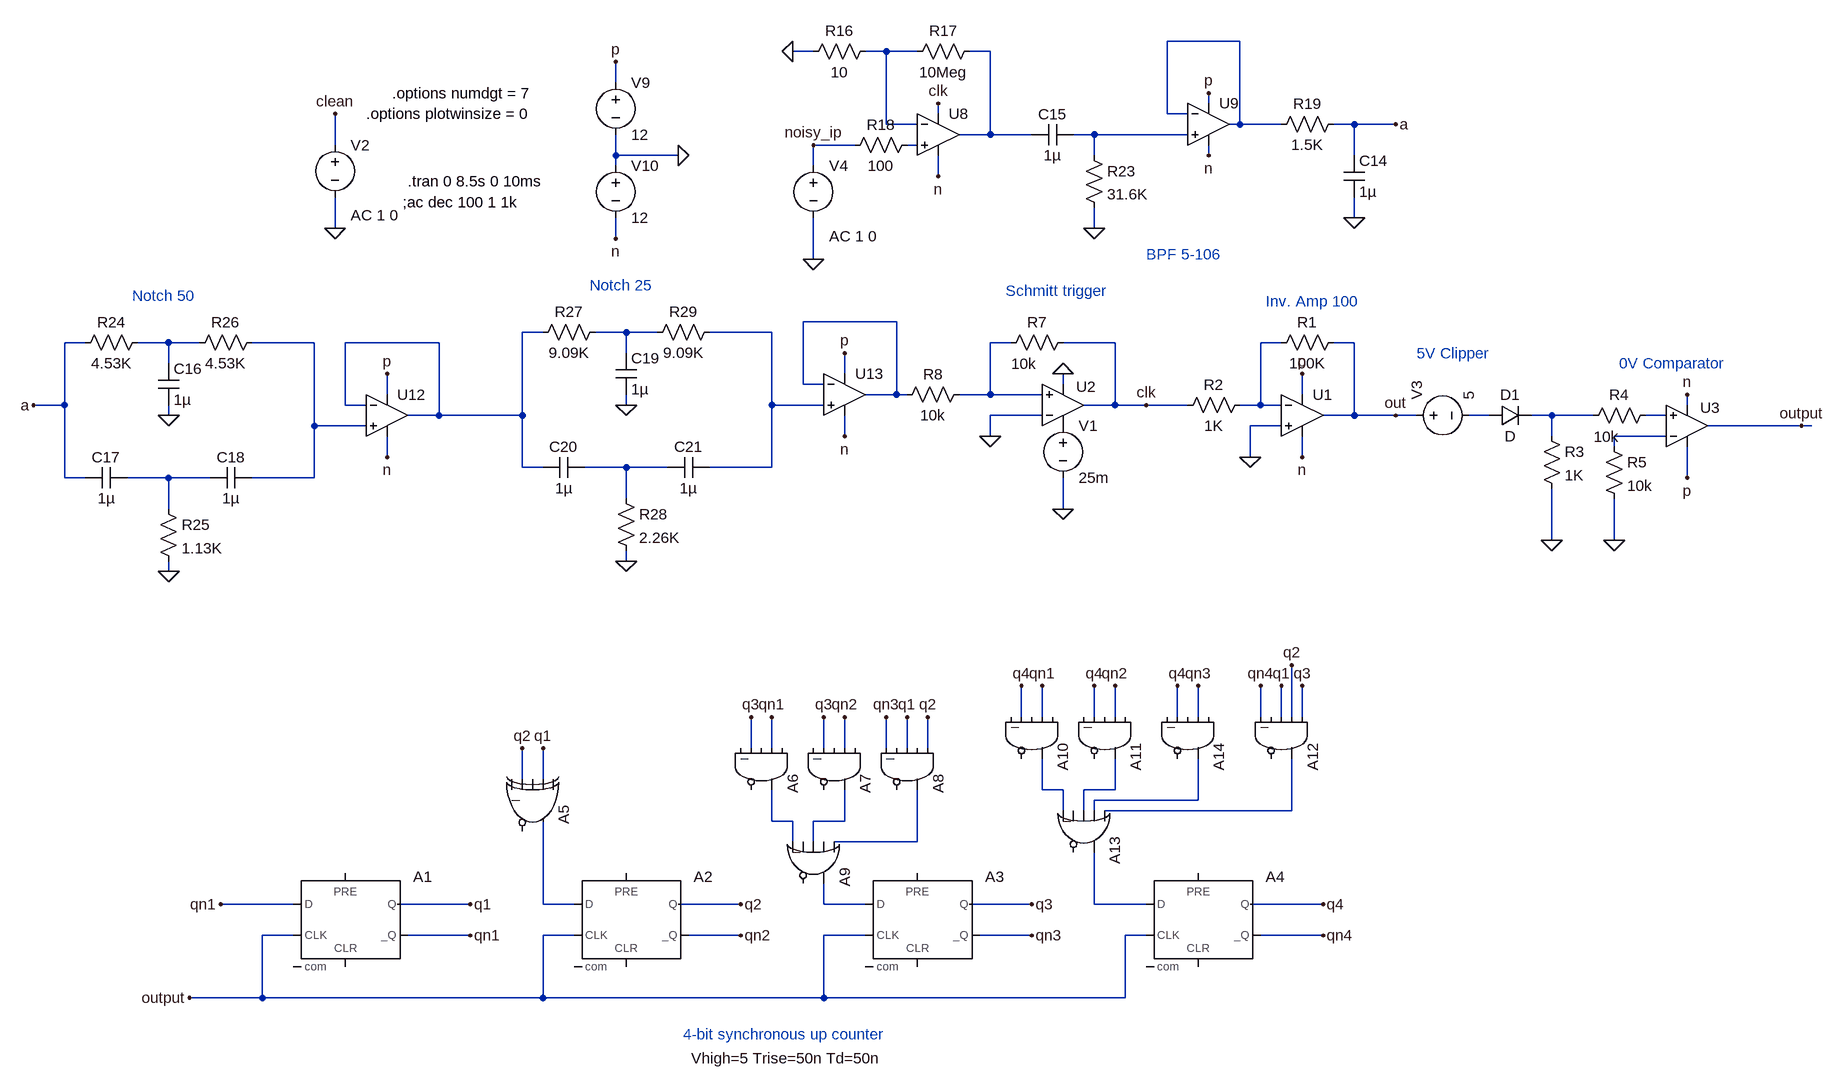
[diagram p0: schematic full ckt.asc]
full ckt.asc, the LTspice schematic file:
Version 4
SHEET 1 4760 1540
WIRE 2384 -832 2272 -832
WIRE 1728 -816 1696 -816
WIRE 1840 -816 1808 -816
WIRE 1888 -816 1840 -816
WIRE 2000 -816 1968 -816
WIRE 1424 -768 1424 -800
WIRE 2336 -736 2336 -752
WIRE 1920 -720 1920 -736
WIRE 2272 -720 2272 -832
WIRE 2304 -720 2272 -720
WIRE 1840 -704 1840 -816
WIRE 1888 -704 1840 -704
WIRE 2384 -704 2384 -832
WIRE 2384 -704 2368 -704
WIRE 2448 -704 2384 -704
WIRE 2560 -704 2528 -704
WIRE 2624 -704 2560 -704
WIRE 2000 -688 2000 -816
WIRE 2000 -688 1952 -688
WIRE 2064 -688 2000 -688
WIRE 2160 -688 2128 -688
WIRE 2304 -688 2160 -688
WIRE 992 -672 992 -720
WIRE 1792 -672 1728 -672
WIRE 1888 -672 1872 -672
WIRE 1424 -656 1424 -688
WIRE 1520 -656 1424 -656
WIRE 2160 -656 2160 -688
WIRE 2336 -656 2336 -672
WIRE 2560 -656 2560 -704
WIRE 1424 -640 1424 -656
WIRE 1728 -640 1728 -672
WIRE 1920 -624 1920 -656
WIRE 2560 -560 2560 -592
WIRE 992 -544 992 -592
WIRE 2160 -544 2160 -576
WIRE 1424 -528 1424 -560
WIRE 1728 -496 1728 -560
WIRE 1856 -400 1712 -400
WIRE 1312 -384 1280 -384
WIRE 1440 -384 1392 -384
WIRE 1488 -384 1440 -384
WIRE 1664 -384 1568 -384
WIRE 608 -368 576 -368
WIRE 736 -368 688 -368
WIRE 784 -368 736 -368
WIRE 960 -368 864 -368
WIRE 1152 -368 1008 -368
WIRE 2032 -368 2000 -368
WIRE 2192 -368 2112 -368
WIRE 2448 -368 2416 -368
WIRE 2560 -368 2528 -368
WIRE 1440 -352 1440 -384
WIRE 736 -336 736 -368
WIRE 1776 -320 1776 -352
WIRE 1712 -304 1712 -400
WIRE 1744 -304 1712 -304
WIRE 2112 -304 2112 -320
WIRE 1072 -288 1072 -320
WIRE 1856 -288 1856 -400
WIRE 1856 -288 1808 -288
WIRE 1872 -288 1856 -288
WIRE 2000 -288 2000 -368
WIRE 2000 -288 1952 -288
WIRE 2080 -288 2000 -288
WIRE 2480 -288 2480 -320
WIRE 576 -272 576 -368
WIRE 576 -272 528 -272
WIRE 1008 -272 1008 -368
WIRE 1040 -272 1008 -272
WIRE 1440 -272 1440 -288
WIRE 1664 -272 1664 -384
WIRE 1744 -272 1664 -272
WIRE 2192 -272 2192 -368
WIRE 2192 -272 2144 -272
WIRE 2240 -272 2192 -272
WIRE 2304 -272 2240 -272
WIRE 2416 -272 2416 -368
WIRE 2416 -272 2384 -272
WIRE 2448 -272 2416 -272
WIRE 3072 -272 3072 -288
WIRE 736 -256 736 -272
WIRE 1152 -256 1152 -368
WIRE 1152 -256 1104 -256
WIRE 1280 -256 1280 -384
WIRE 1280 -256 1152 -256
WIRE 2080 -256 2000 -256
WIRE 2560 -256 2560 -368
WIRE 2560 -256 2512 -256
WIRE 2624 -256 2560 -256
WIRE 2656 -256 2624 -256
WIRE 2768 -256 2736 -256
WIRE 2864 -256 2832 -256
WIRE 2928 -256 2864 -256
WIRE 3040 -256 3008 -256
WIRE 960 -240 960 -368
WIRE 1040 -240 960 -240
WIRE 2448 -240 2400 -240
WIRE 3248 -240 3104 -240
WIRE 3264 -240 3248 -240
WIRE 1776 -224 1776 -256
WIRE 2000 -224 2000 -256
WIRE 2864 -224 2864 -256
WIRE 3040 -224 2960 -224
WIRE 2960 -208 2960 -224
WIRE 1072 -192 1072 -224
WIRE 2400 -192 2400 -240
WIRE 2480 -192 2480 -224
WIRE 1280 -176 1280 -256
WIRE 1312 -176 1280 -176
WIRE 1440 -176 1376 -176
WIRE 1504 -176 1440 -176
WIRE 1664 -176 1664 -272
WIRE 1664 -176 1568 -176
WIRE 576 -160 576 -272
WIRE 608 -160 576 -160
WIRE 736 -160 672 -160
WIRE 800 -160 736 -160
WIRE 960 -160 960 -240
WIRE 960 -160 864 -160
WIRE 3072 -160 3072 -208
WIRE 1440 -128 1440 -176
WIRE 736 -112 736 -160
WIRE 2112 -112 2112 -160
WIRE 2864 -64 2864 -144
WIRE 2960 -64 2960 -128
WIRE 1440 -32 1440 -48
WIRE 736 -16 736 -32
WIRE 2048 208 2048 160
WIRE 2080 208 2080 160
WIRE 2160 208 2160 160
WIRE 2192 208 2192 160
WIRE 2288 208 2288 160
WIRE 2320 208 2320 160
WIRE 2416 208 2416 160
WIRE 2448 208 2448 160
WIRE 2464 208 2464 128
WIRE 2480 208 2480 160
WIRE 1632 256 1632 208
WIRE 1664 256 1664 208
WIRE 1744 256 1744 208
WIRE 1776 256 1776 208
WIRE 1840 256 1840 208
WIRE 1872 256 1872 208
WIRE 1904 256 1904 208
WIRE 1280 304 1280 256
WIRE 1312 304 1312 256
WIRE 2080 320 2080 272
WIRE 2112 320 2080 320
WIRE 2192 320 2192 272
WIRE 2192 320 2144 320
WIRE 2320 336 2320 272
WIRE 2320 336 2160 336
WIRE 2112 352 2112 320
WIRE 2144 352 2144 320
WIRE 2160 352 2160 336
WIRE 2464 352 2464 272
WIRE 2464 352 2176 352
WIRE 1664 368 1664 320
WIRE 1696 368 1664 368
WIRE 1776 368 1776 320
WIRE 1776 368 1728 368
WIRE 1696 400 1696 368
WIRE 1728 400 1728 368
WIRE 1888 400 1888 320
WIRE 1888 400 1760 400
WIRE 928 496 816 496
WIRE 1200 496 1088 496
WIRE 1312 496 1312 368
WIRE 1360 496 1312 496
WIRE 1616 496 1520 496
WIRE 1744 496 1744 464
WIRE 1808 496 1744 496
WIRE 2064 496 1968 496
WIRE 2160 496 2160 416
WIRE 2240 496 2160 496
WIRE 2512 496 2400 496
WIRE 928 544 880 544
WIRE 1200 544 1104 544
WIRE 1360 544 1312 544
WIRE 1616 544 1536 544
WIRE 1808 544 1744 544
WIRE 2064 544 1984 544
WIRE 2240 544 2208 544
WIRE 2512 544 2416 544
WIRE 880 640 880 544
WIRE 880 640 768 640
WIRE 1312 640 1312 544
WIRE 1312 640 880 640
WIRE 1744 640 1744 544
WIRE 1744 640 1312 640
WIRE 2208 640 2208 544
WIRE 2208 640 1744 640
FLAG 992 -544 0
FLAG 992 -720 clean
FLAG 1520 -656 0
FLAG 1424 -800 p
FLAG 1424 -528 n
FLAG 1696 -816 0
FLAG 1728 -496 0
FLAG 2336 -752 p
FLAG 2160 -544 0
FLAG 2560 -560 0
FLAG 736 -256 0
FLAG 736 -16 0
FLAG 1072 -320 p
FLAG 1440 -272 0
FLAG 1440 -32 0
FLAG 1776 -352 p
FLAG 2624 -256 out
FLAG 2336 -656 n
FLAG 1072 -192 n
FLAG 1776 -224 n
FLAG 2112 -112 0
FLAG 2240 -272 clk
FLAG 2112 -320 0
FLAG 1920 -624 n
FLAG 1920 -736 clk
FLAG 2480 -320 p
FLAG 2480 -192 n
FLAG 2400 -192 0
FLAG 2000 -224 0
FLAG 2624 -704 a
FLAG 528 -272 a
FLAG 2864 -64 0
FLAG 2960 -64 0
FLAG 3072 -160 p
FLAG 3072 -288 n
FLAG 3248 -240 output
FLAG 1728 -672 noisy_ip
FLAG 1200 496 q1
FLAG 1200 544 qn1
FLAG 1616 496 q2
FLAG 1616 544 qn2
FLAG 2064 496 q3
FLAG 2064 544 qn3
FLAG 2512 496 q4
FLAG 2512 544 qn4
FLAG 816 496 qn1
FLAG 1280 256 q2
FLAG 1312 256 q1
FLAG 1632 208 q3
FLAG 1744 208 q3
FLAG 1664 208 qn1
FLAG 1776 208 qn2
FLAG 1840 208 qn3
FLAG 1872 208 q1
FLAG 1904 208 q2
FLAG 2048 160 q4
FLAG 2160 160 q4
FLAG 2080 160 qn1
FLAG 2192 160 qn2
FLAG 2416 160 qn4
FLAG 2448 160 q1
FLAG 2480 160 q3
FLAG 2288 160 q4
FLAG 2320 160 qn3
FLAG 2464 128 q2
FLAG 768 640 output
SYMBOL voltage 992 -688 R0
WINDOW 3 24 96 Invisible 2
WINDOW 123 24 124 Left 2
WINDOW 39 0 0 Left 0
SYMATTR Value PWL file="C:\Users\SHLOK JAGUSHTE\Downloads\normal_ecg_sample (just for reference).txt"
SYMATTR Value2 AC 1 0
SYMATTR InstName V2
SYMBOL voltage 1424 -784 R0
WINDOW 123 0 0 Left 0
WINDOW 39 0 0 Left 0
SYMATTR InstName V9
SYMATTR Value 12
SYMBOL voltage 1424 -656 R0
WINDOW 123 0 0 Left 0
WINDOW 39 0 0 Left 0
SYMATTR InstName V10
SYMATTR Value 12
SYMBOL Opamps\\UniversalOpamp2 1920 -688 R0
SYMATTR InstName U8
SYMBOL res 1824 -832 R90
WINDOW 0 0 56 VBottom 2
WINDOW 3 32 56 VTop 2
SYMATTR InstName R16
SYMATTR Value 10
SYMATTR SpiceLine tol=1 pwr=0.1
SYMBOL res 1984 -832 R90
WINDOW 0 0 56 VBottom 2
WINDOW 3 32 56 VTop 2
SYMATTR InstName R17
SYMATTR Value 10Meg
SYMATTR SpiceLine tol=1 pwr=0.1
SYMBOL res 1888 -688 R90
WINDOW 0 0 56 VBottom 2
WINDOW 3 32 56 VTop 2
SYMATTR InstName R18
SYMATTR Value 100
SYMATTR SpiceLine tol=1 pwr=0.1
SYMBOL Opamps\\UniversalOpamp2 2336 -704 R0
SYMATTR InstName U9
SYMBOL cap 2544 -656 R0
SYMATTR InstName C14
SYMATTR Value 1µ
SYMATTR SpiceLine V=4 Irms=0 Rser=0 Lser=0
SYMBOL res 2432 -688 R270
WINDOW 0 32 56 VTop 2
WINDOW 3 0 56 VBottom 2
SYMATTR InstName R19
SYMATTR Value 1.5K
SYMATTR SpiceLine tol=1 pwr=0.1
SYMBOL cap 2128 -704 R90
WINDOW 0 0 32 VBottom 2
WINDOW 3 32 32 VTop 2
SYMATTR InstName C15
SYMATTR Value 1µ
SYMATTR SpiceLine V=4 Irms=0 Rser=0 Lser=0
SYMBOL res 2144 -672 R0
SYMATTR InstName R23
SYMATTR Value 31.6K
SYMATTR SpiceLine tol=1 pwr=0.1
SYMBOL res 704 -384 R90
WINDOW 0 0 56 VBottom 2
WINDOW 3 32 56 VTop 2
SYMATTR InstName R24
SYMATTR Value 4.53K
SYMATTR SpiceLine tol=1 pwr=0.1
SYMBOL cap 720 -336 R0
SYMATTR InstName C16
SYMATTR Value 1µ
SYMATTR SpiceLine V=4 Irms=0 Rser=0 Lser=0 mfg="Murata" pn="GRM153R60G105ME95" type="X5R"
SYMBOL res 720 -128 R0
SYMATTR InstName R25
SYMATTR Value 1.13K
SYMATTR SpiceLine tol=1 pwr=0.1
SYMBOL cap 672 -176 R90
WINDOW 0 0 32 VBottom 2
WINDOW 3 32 32 VTop 2
SYMATTR InstName C17
SYMATTR Value 1µ
SYMATTR SpiceLine V=4 Irms=0 Rser=0 Lser=0 mfg="Murata" pn="GRM155R70G105MA12" type="X7R"
SYMBOL cap 864 -176 R90
WINDOW 0 0 32 VBottom 2
WINDOW 3 32 32 VTop 2
SYMATTR InstName C18
SYMATTR Value 1µ
SYMATTR SpiceLine V=4 Irms=0 Rser=0 Lser=0 mfg="Murata" pn="GRM155R70G105MA12" type="X7R"
SYMBOL res 880 -384 R90
WINDOW 0 0 56 VBottom 2
WINDOW 3 32 56 VTop 2
SYMATTR InstName R26
SYMATTR Value 4.53K
SYMATTR SpiceLine tol=1 pwr=0.1
SYMBOL Opamps\\UniversalOpamp2 1072 -256 R0
SYMATTR InstName U12
SYMBOL res 1408 -400 R90
WINDOW 0 0 56 VBottom 2
WINDOW 3 32 56 VTop 2
SYMATTR InstName R27
SYMATTR Value 9.09K
SYMATTR SpiceLine tol=1 pwr=0.1
SYMBOL cap 1424 -352 R0
SYMATTR InstName C19
SYMATTR Value 1µ
SYMATTR SpiceLine V=4 Irms=0 Rser=0 Lser=0 mfg="Murata" pn="GRM153R60G105ME95" type="X5R"
SYMBOL res 1424 -144 R0
SYMATTR InstName R28
SYMATTR Value 2.26K
SYMATTR SpiceLine tol=1 pwr=0.1
SYMBOL cap 1376 -192 R90
WINDOW 0 0 32 VBottom 2
WINDOW 3 32 32 VTop 2
SYMATTR InstName C20
SYMATTR Value 1µ
SYMATTR SpiceLine V=4 Irms=0 Rser=0 Lser=0 mfg="Murata" pn="GRM155R70G105MA12" type="X7R"
SYMBOL cap 1568 -192 R90
WINDOW 0 0 32 VBottom 2
WINDOW 3 32 32 VTop 2
SYMATTR InstName C21
SYMATTR Value 1µ
SYMATTR SpiceLine V=4 Irms=0 Rser=0 Lser=0 mfg="Murata" pn="GRM155R70G105MA12" type="X7R"
SYMBOL Opamps\\UniversalOpamp2 1776 -288 R0
SYMATTR InstName U13
SYMBOL res 1584 -400 R90
WINDOW 0 0 56 VBottom 2
WINDOW 3 32 56 VTop 2
SYMATTR InstName R29
SYMATTR Value 9.09K
SYMATTR SpiceLine tol=1 pwr=0.1
SYMBOL voltage 1728 -656 R0
WINDOW 3 24 99 Invisible 2
WINDOW 123 24 124 Left 2
WINDOW 39 0 0 Left 0
SYMATTR Value PWL file="C:\Users\SHLOK JAGUSHTE\Downloads\noisy_ecg_sample.txt"
SYMATTR Value2 AC 1 0
SYMATTR InstName V4
SYMBOL Opamps\\UniversalOpamp2 2112 -272 M180
WINDOW 0 20 28 Left 2
SYMATTR InstName U2
SYMBOL res 2128 -384 R90
WINDOW 0 0 56 VBottom 2
WINDOW 3 33 76 VTop 2
SYMATTR InstName R7
SYMATTR Value 10k
SYMATTR SpiceLine tol=1 pwr=0.1
SYMBOL voltage 2112 -256 R0
WINDOW 123 0 0 Left 0
WINDOW 39 0 0 Left 0
SYMATTR InstName V1
SYMATTR Value 25m
SYMBOL res 1968 -304 R90
WINDOW 0 0 56 VBottom 2
WINDOW 3 32 56 VTop 2
SYMATTR InstName R8
SYMATTR Value 10k
SYMATTR SpiceLine tol=1 pwr=0.1
SYMBOL Opamps\\UniversalOpamp2 2480 -256 R0
SYMATTR InstName U1
SYMBOL res 2544 -384 R90
WINDOW 0 0 56 VBottom 2
WINDOW 3 32 56 VTop 2
SYMATTR InstName R1
SYMATTR Value 100K
SYMATTR SpiceLine tol=1 pwr=0.1
SYMBOL res 2400 -288 R90
WINDOW 0 0 56 VBottom 2
WINDOW 3 32 56 VTop 2
SYMATTR InstName R2
SYMATTR Value 1K
SYMATTR SpiceLine tol=1 pwr=0.1
SYMBOL voltage 2640 -256 R270
WINDOW 123 0 0 Left 0
WINDOW 39 0 0 Left 0
SYMATTR InstName V3
SYMATTR Value 5
SYMBOL diode 2768 -240 R270
WINDOW 0 32 32 VTop 2
WINDOW 3 0 32 VBottom 2
SYMATTR InstName D1
SYMBOL res 2848 -240 R0
SYMATTR InstName R3
SYMATTR Value 1K
SYMATTR SpiceLine tol=1 pwr=0.1
SYMBOL Opamps\\UniversalOpamp2 3072 -240 M180
WINDOW 0 20 28 Left 2
SYMATTR InstName U3
SYMBOL res 3024 -272 R90
WINDOW 0 0 56 VBottom 2
WINDOW 3 33 76 VTop 2
SYMATTR InstName R4
SYMATTR Value 10k
SYMATTR SpiceLine tol=1 pwr=0.1
SYMBOL res 2944 -224 R0
SYMATTR InstName R5
SYMATTR Value 10k
SYMATTR SpiceLine tol=1 pwr=0.1
SYMBOL Digital\\dflop 1008 448 R0
WINDOW 3 8 12 Invisible 2
SYMATTR Value Vhigh=5 Trise=50n Td=50n
SYMATTR InstName A1
SYMBOL Digital\\dflop 1440 448 R0
WINDOW 3 8 168 Invisible 2
SYMATTR Value Vhigh=5 Trise=50n Td=50n
SYMATTR InstName A2
SYMBOL Digital\\dflop 1888 448 R0
WINDOW 3 8 168 Invisible 2
SYMATTR Value Vhigh=5 Trise=50n Td=50n
SYMATTR InstName A3
SYMBOL Digital\\dflop 2320 448 R0
WINDOW 3 -780 285 Left 2
SYMATTR Value Vhigh=5 Trise=50n Td=50n
SYMATTR InstName A4
SYMBOL Digital\\xor 1360 352 R90
WINDOW 3 16 52 Invisible 2
SYMATTR Value Vhigh=5 Trise=50n Td=50n
SYMATTR InstName A5
SYMBOL Digital\\and 1712 288 R90
WINDOW 3 16 112 Invisible 2
SYMATTR Value Vhigh=5 Trise=50n Td=50n
SYMATTR InstName A6
SYMBOL Digital\\and 1824 288 R90
WINDOW 3 16 112 Invisible 2
SYMATTR Value Vhigh=5 Trise=50n Td=50n
SYMATTR InstName A7
SYMBOL Digital\\and 1936 288 R90
WINDOW 3 16 112 Invisible 2
SYMATTR Value Vhigh=5 Trise=50n Td=50n
SYMATTR InstName A8
SYMBOL Digital\\or 1792 432 R90
WINDOW 3 -8 128 Invisible 2
SYMATTR Value Vhigh=5 Trise=50n Td=50n
SYMATTR InstName A9
SYMBOL Digital\\and 2128 240 R90
WINDOW 3 16 112 Invisible 2
SYMATTR Value Vhigh=5 Trise=50n Td=50n
SYMATTR InstName A10
SYMBOL Digital\\and 2240 240 R90
WINDOW 3 16 112 Invisible 2
SYMATTR Value Vhigh=5 Trise=50n Td=50n
SYMATTR InstName A11
SYMBOL Digital\\and 2512 240 R90
WINDOW 3 16 112 Invisible 2
SYMATTR Value Vhigh=5 Trise=50n Td=50n
SYMATTR InstName A12
SYMBOL Digital\\or 2208 384 R90
WINDOW 3 -8 128 Invisible 2
SYMATTR Value Vhigh=5 Trise=50n Td=50n
SYMATTR InstName A13
SYMBOL Digital\\and 2368 240 R90
WINDOW 3 16 112 Invisible 2
SYMATTR Value Vhigh=5 Trise=50n Td=50n
SYMATTR InstName A14
TEXT 1080 -752 Left 2 !.options numdgt = 7
TEXT 1040 -720 Left 2 !.options plotwinsize = 0
TEXT 1104 -616 Left 2 !.tran 0 8.5s 0 10ms
TEXT 1096 -584 Left 2 !;ac dec 100 1 1k
TEXT 2240 -504 Left 2 ;BPF 5-106
TEXT 680 -440 Left 2 ;Notch 50
TEXT 1384 -456 Left 2 ;Notch 25
TEXT 2024 -448 Left 2 ;Schmitt trigger
TEXT 2424 -432 Left 2 ;Inv. Amp 100
TEXT 2656 -352 Left 2 ;5V Clipper
TEXT 2968 -336 Left 2 ;0V Comparator
TEXT 1528 696 Left 2 ;4-bit synchronous up counter

The netlist it stands for:
* full ckt.asc
V2 clean 0 PWL file="C:\Users\SHLOK JAGUSHTE\Downloads\normal_ecg_sample (just for reference).txt" AC 1 0
V9 p 0 12
V10 0 n 12
XU8 N005 N002 clk n N003 level.2 Avol=1Meg GBW=10Meg Slew=10Meg ilimit=25m rail=0 Vos=0 phimargin=45 en=0 enk=0 in=0 ink=0 Rin=500Meg  ; pins IN+ IN- V+ V- OUT
R16 N002 0 10 tol=1 pwr=0.1
R17 N003 N002 10Meg tol=1 pwr=0.1
R18 N005 noisy_ip 100 tol=1 pwr=0.1
XU9 N004 N001 p n N001 level.2 Avol=1Meg GBW=10Meg Slew=10Meg ilimit=25m rail=0 Vos=0 phimargin=45 en=0 enk=0 in=0 ink=0 Rin=500Meg  ; pins IN+ IN- V+ V- OUT
C14 a 0 1µ V=4 Irms=0 Rser=0 Lser=0
R19 N001 a 1.5K tol=1 pwr=0.1
C15 N004 N003 1µ V=4 Irms=0 Rser=0 Lser=0
R23 N004 0 31.6K tol=1 pwr=0.1
R24 N010 a 4.53K tol=1 pwr=0.1
C16 N010 0 1µ V=4 Irms=0 Rser=0 Lser=0 mfg="Murata" pn="GRM153R60G105ME95" type="X5R"
R25 N019 0 1.13K tol=1 pwr=0.1
C17 N019 a 1µ V=4 Irms=0 Rser=0 Lser=0 mfg="Murata" pn="GRM155R70G105MA12" type="X7R"
C18 N011 N019 1µ V=4 Irms=0 Rser=0 Lser=0 mfg="Murata" pn="GRM155R70G105MA12" type="X7R"
R26 N011 N010 4.53K tol=1 pwr=0.1
XU12 N011 N007 p n N007 level.2 Avol=1Meg GBW=10Meg Slew=10Meg ilimit=25m rail=0 Vos=0 phimargin=45 en=0 enk=0 in=0 ink=0 Rin=500Meg  ; pins IN+ IN- V+ V- OUT
R27 N008 N007 9.09K tol=1 pwr=0.1
C19 N008 0 1µ V=4 Irms=0 Rser=0 Lser=0 mfg="Murata" pn="GRM153R60G105ME95" type="X5R"
R28 N018 0 2.26K tol=1 pwr=0.1
C20 N018 N007 1µ V=4 Irms=0 Rser=0 Lser=0 mfg="Murata" pn="GRM155R70G105MA12" type="X7R"
C21 N009 N018 1µ V=4 Irms=0 Rser=0 Lser=0 mfg="Murata" pn="GRM155R70G105MA12" type="X7R"
XU13 N009 N006 p n N006 level.2 Avol=1Meg GBW=10Meg Slew=10Meg ilimit=25m rail=0 Vos=0 phimargin=45 en=0 enk=0 in=0 ink=0 Rin=500Meg  ; pins IN+ IN- V+ V- OUT
R29 N009 N008 9.09K tol=1 pwr=0.1
V4 noisy_ip 0 PWL file="C:\Users\SHLOK JAGUSHTE\Downloads\noisy_ecg_sample.txt" AC 1 0
XU2 N012 0 P001 0 clk level.2 Avol=1Meg GBW=10Meg Slew=10Meg ilimit=25m rail=0 Vos=0 phimargin=45 en=0 enk=0 in=0 ink=0 Rin=500Meg  ; pins IN+ IN- V+ V- OUT
R7 clk N012 10k tol=1 pwr=0.1
V1 P001 0 25m
R8 N012 N006 10k tol=1 pwr=0.1
XU1 0 N013 p n out level.2 Avol=1Meg GBW=10Meg Slew=10Meg ilimit=25m rail=0 Vos=0 phimargin=45 en=0 enk=0 in=0 ink=0 Rin=500Meg  ; pins IN+ IN- V+ V- OUT
R1 out N013 100K tol=1 pwr=0.1
R2 N013 clk 1K tol=1 pwr=0.1
V3 out N014 5
D1 N014 N015 D
R3 N015 0 1K tol=1 pwr=0.1
XU3 N016 N017 p n output level.2 Avol=1Meg GBW=10Meg Slew=10Meg ilimit=25m rail=0 Vos=0 phimargin=45 en=0 enk=0 in=0 ink=0 Rin=500Meg  ; pins IN+ IN- V+ V- OUT
R4 N016 N015 10k tol=1 pwr=0.1
R5 N017 0 10k tol=1 pwr=0.1
A1 qn1 0 output 0 0 qn1 q1 0 DFLOP Vhigh=5 Trise=50n Td=50n
A2 N027 0 output 0 0 qn2 q2 0 DFLOP Vhigh=5 Trise=50n Td=50n
A3 N028 0 output 0 0 qn3 q3 0 DFLOP Vhigh=5 Trise=50n Td=50n
A4 N029 0 output 0 0 qn4 q4 0 DFLOP Vhigh=5 Trise=50n Td=50n
A5 0 q1 0 q2 0 0 N027 0 XOR Vhigh=5 Trise=50n Td=50n
A6 0 qn1 0 q3 0 0 N024 0 AND Vhigh=5 Trise=50n Td=50n
A7 0 qn2 0 q3 0 0 N025 0 AND Vhigh=5 Trise=50n Td=50n
A8 q2 0 q1 0 qn3 0 N026 0 AND Vhigh=5 Trise=50n Td=50n
A9 N026 0 N025 0 N024 0 N028 0 OR Vhigh=5 Trise=50n Td=50n
A10 0 qn1 0 q4 0 0 N020 0 AND Vhigh=5 Trise=50n Td=50n
A11 0 qn2 0 q4 0 0 N021 0 AND Vhigh=5 Trise=50n Td=50n
A12 q3 q2 q1 0 qn4 0 N023 0 AND Vhigh=5 Trise=50n Td=50n
A13 N023 N022 N021 0 N020 0 N029 0 OR Vhigh=5 Trise=50n Td=50n
A14 0 qn3 0 q4 0 0 N022 0 AND Vhigh=5 Trise=50n Td=50n
.model D D
.lib standard.dio
.options numdgt = 7
.options plotwinsize = 0
.tran 0 8.5s 0 10ms
;ac dec 100 1 1k
* BPF 5-106
* Notch 50
* Notch 25
* Schmitt trigger
* Inv. Amp 100
* 5V Clipper
* 0V Comparator
* 4-bit synchronous up counter
.lib UniversalOpamps2.sub
.backanno
.end